# Altium schematic sheet TP_IHM_BUZZER.SchDoc
size A4
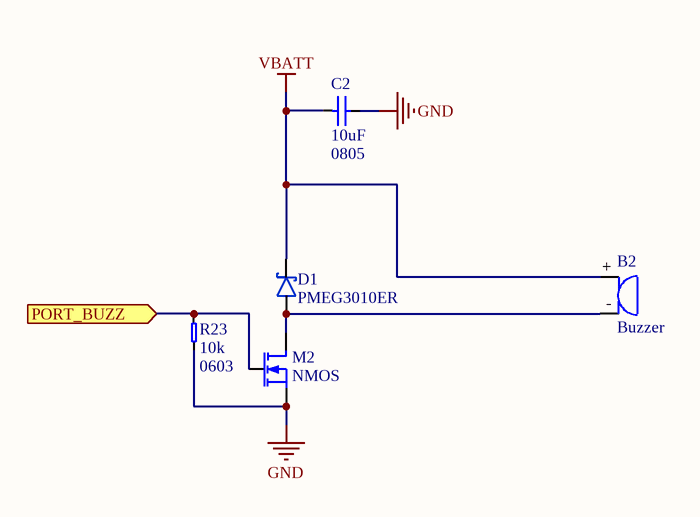
[diagram p0: TP_IHM_BUZZER.SchDoc]

## Parts
B2  Buzzer  [SD160709]
C2  value 10uF  Package: 0805  [0805_CAP_LD]  (hidden comment: CerCap)
D1  PMEG3010ER  [SOD123W]
M2  NMOS  [MOSFET-SOT23]
R23  value 10k  Package: 0603  [0603_RES_LD]  (hidden comment: Resistor)

## Ports
PORT_BUZZ (in)

## Nets
GND: C2.2 M2.S R23.1
VBATT: B2.+ C2.1 D1.K
PORT_BUZZ: M2.G R23.2 ; port PORT_BUZZ
NetB2_-: B2.- D1.A M2.D

## Library data of the parts
B2 = SD160709: TDK SD160709 Buzzer; Reference: SD160709
C2 = CerCap: Ceramic Capacitor; Type: *; Voltage/Power: *
D1 = Schottky_PMEG3010ER: Nexperia 1A low Vf Mega Schottky barrier rectifier; Reference: PMEG3010ER
M2 = N-MOSFET: N MOSFET
R23 = Resistor: Precision: *